# Altium schematic sheet DCDC_TPS62200_3V3.SchDoc
size A4
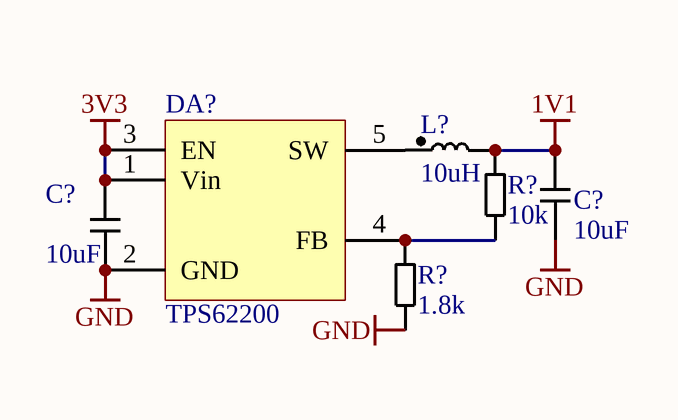
[diagram p0: DCDC_TPS62200_3V3.SchDoc]

## Parts
(Parts that share a designator on the sheet are numbered #1, #2 ... from top to bottom, then left to right.)
C?#1  10uF  [C0603]
C?#2  10uF  [C0603]
DA?  TPS62200  [SOT-23-5]
L?  10uH  [L0805]
R?#1  10k  [R0603]
R?#2  1.8k  [R0603]

## Nets
1V1: C?#1.1 L?.2 R?#1.2
3V3: C?#2.1 DA?.1(Vin) DA?.3(EN)
GND: C?#1.2 C?#2.2 DA?.2(GND) R?#2.1
NetDA?_4: DA?.4(FB) R?#1.1 R?#2.2
NetDA?_5: DA?.5(SW) L?.1

## Library data of the parts
C?#1 C?#2 = C: Capacitor
DA? = TPS62200: TI DC-DC buck 300ma SOT-23-5 package
L? = L: Inductor
R?#1 R?#2 = R: Resistor